# Altium project ACS_MainBrd.PrjPcb
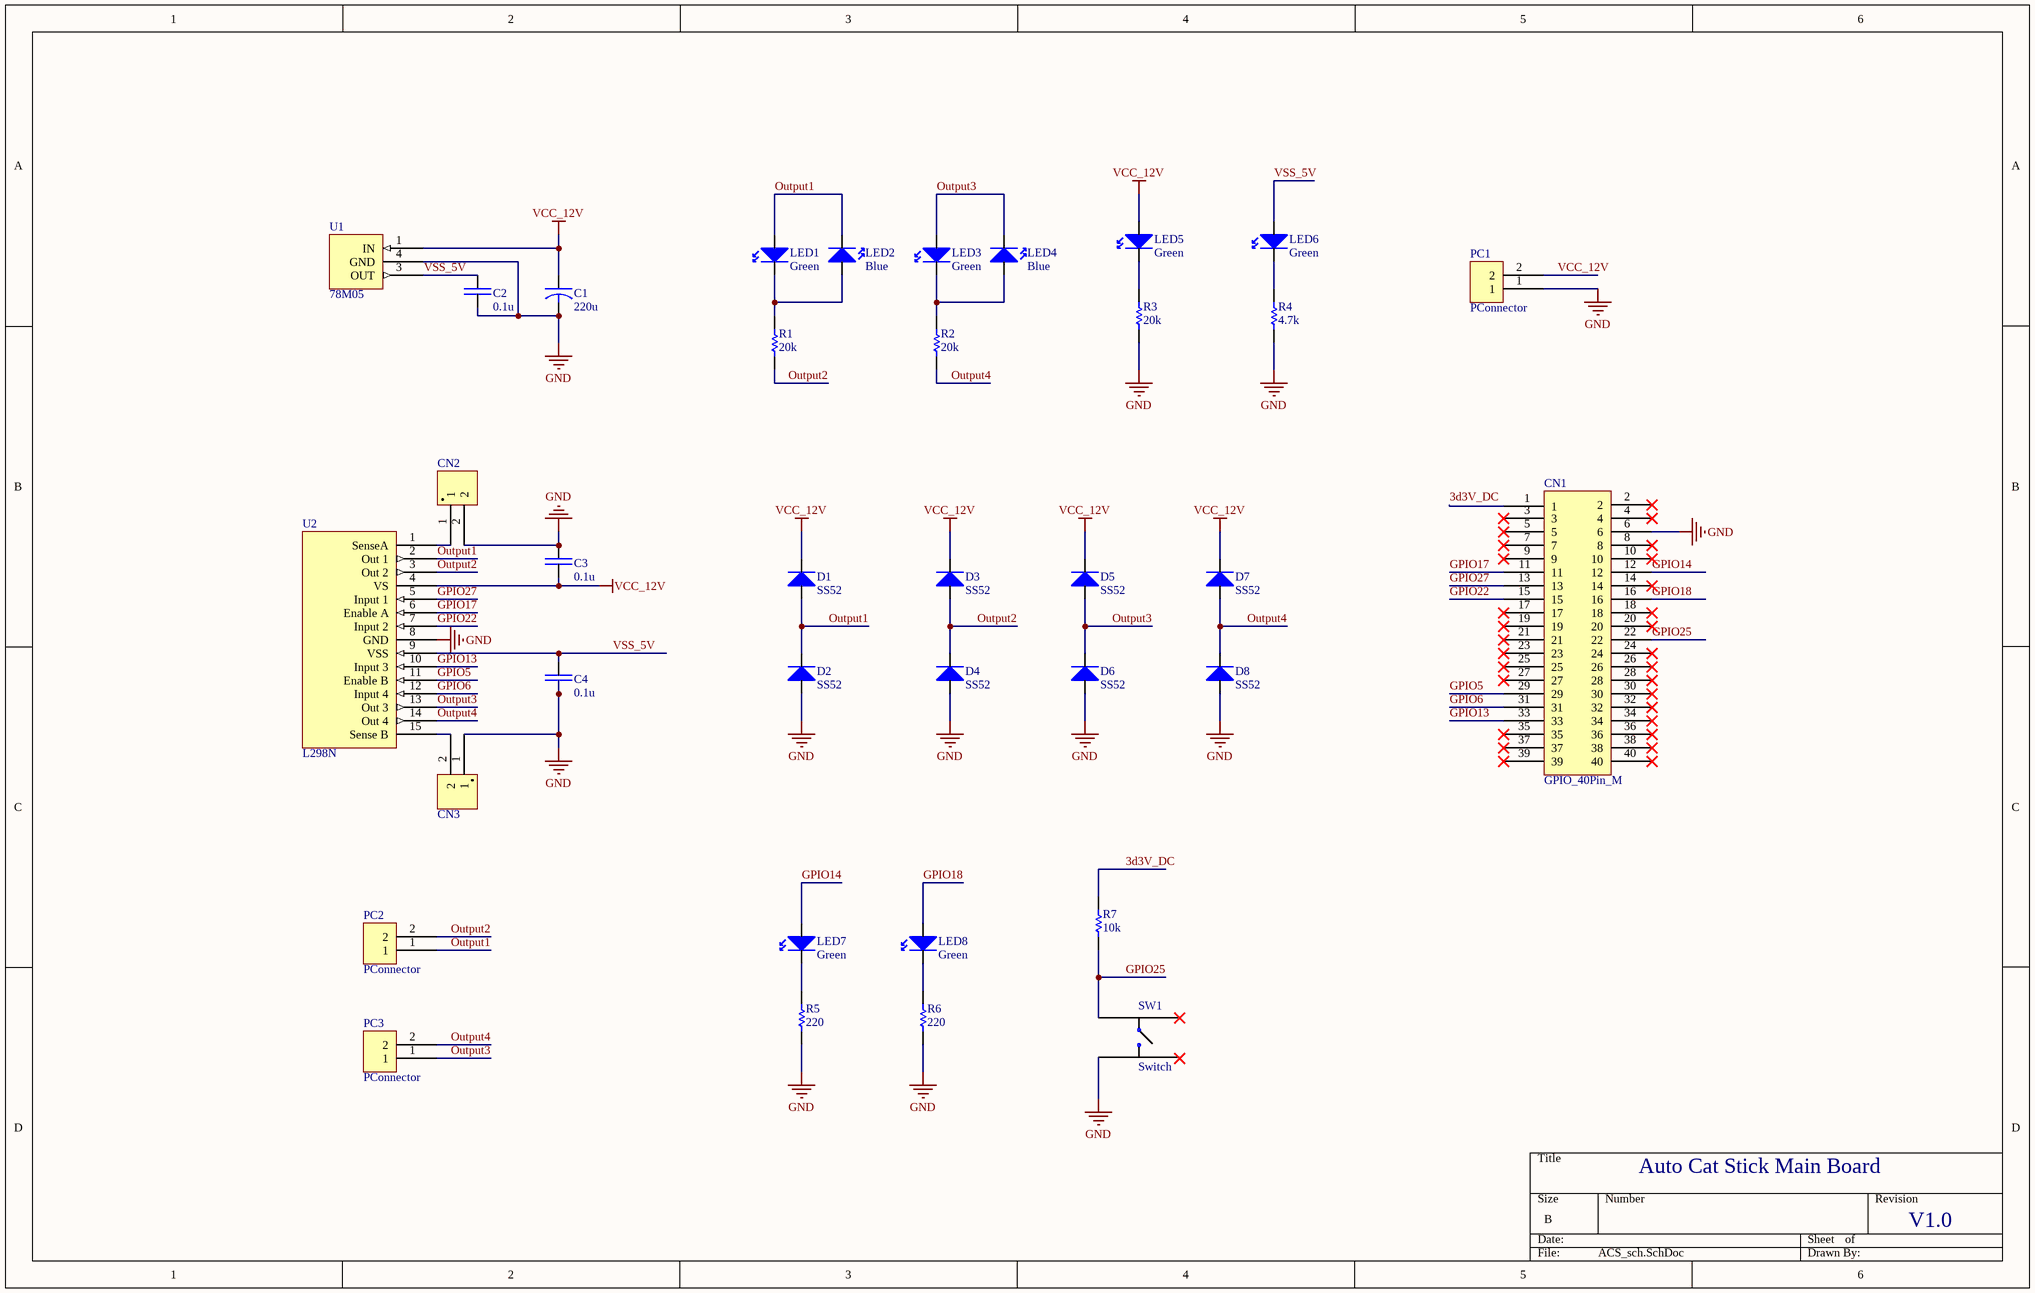
[diagram p0: ACS_sch.SchDoc]
1 sheet, 36 parts. Net scope: global (net labels, ports and power ports of the same name join across sheets).
Board files: ACS_PCB_P1.PcbDoc, ACS_PCB_P2.PcbDoc

## Sheet ACS_sch.SchDoc
size B; SheetNumber: 1; SheetTotal: 1

### Parts
C1  220u  [C0605]
C2  0.1u  [C0603]
C3  0.1u  [C0603]
C4  0.1u  [C0603]
CN1  GPIO_40Pin_M  [GPIO_40Pin_M]
CN2  Connector  [2PIN]  (value not drawn)
CN3  Connector  [2PIN]  (value not drawn)
D1  SS52  [SMC(DO-214AB)]
D2  SS52  [SMC(DO-214AB)]
D3  SS52  [SMC(DO-214AB)]
D4  SS52  [SMC(DO-214AB)]
D5  SS52  [SMC(DO-214AB)]
D6  SS52  [SMC(DO-214AB)]
D7  SS52  [SMC(DO-214AB)]
D8  SS52  [SMC(DO-214AB)]
LED1  Green  [LED0603]
LED2  Blue  [LED0603]
LED3  Green  [LED0603]
LED4  Blue  [LED0603]
LED5  Green  [LED0603]
LED6  Green  [LED0603]
LED7  Green  [LED0603]
LED8  Green  [LED0603]
PC1  PConnector  [PC_2Pin]
PC2  PConnector  [PC_2Pin]
PC3  PConnector  [PC_2Pin]
R1  20k  [R0603]
R2  20k  [R0603]
R3  20k  [R0603]
R4  4.7k  [R0603]
R5  220  [R0603]
R6  220  [R0603]
R7  10k  [R0603]
SW1  Switch  [Switch]
U1  78M05  [78M05]
U2  L298N  [L298N]

### Nets
GND: C1.2 C2.2 C3.1 C4.1 CN1.6 CN2.2 CN3.1 D2.2 D4.2 D6.2 D8.2 PC1.1 R3.1 R4.1 R5.1 R6.1 SW1.3 U1.4(GND) U2.8(GND)
VCC_12V: C1.1 C3.2 D1.1 D3.1 D5.1 D7.1 LED5.2 PC1.2 U1.1(IN) U2.4(VS)
3d3V_DC: CN1.1 R7.2
GPIO5: CN1.29 U2.11(Enable_B)
GPIO6: CN1.31 U2.12(Input_4)
GPIO13: CN1.33 U2.10(Input_3)
GPIO14: CN1.12 LED7.2
GPIO17: CN1.11 U2.6(Enable_A)
GPIO18: CN1.16 LED8.2
GPIO22: CN1.15 U2.7(Input_2)
GPIO25: CN1.22 R7.1 SW1.1
GPIO27: CN1.13 U2.5(Input_1)
Output1: D1.2 D2.1 LED1.2 LED2.1 PC2.1 U2.2(Out_1)
Output2: D3.2 D4.1 PC2.2 R1.1 U2.3(Out_2)
Output3: D5.2 D6.1 LED3.2 LED4.1 PC3.1 U2.13(Out_3)
Output4: D7.2 D8.1 PC3.2 R2.1 U2.14(Out_4)
VSS_5V: C2.1 C4.2 LED6.2 U1.3(OUT) U2.9(VSS)
NetCN2_1: CN2.1 U2.1(SenseA)
NetCN3_2: CN3.2 U2.15(Sense_B)
NetLED1_1: LED1.1 LED2.2 R1.2
NetLED3_1: LED3.1 LED4.2 R2.2
NetLED5_1: LED5.1 R3.2
NetLED6_1: LED6.1 R4.2
NetLED7_1: LED7.1 R5.2
NetLED8_1: LED8.1 R6.2

Not connected (* = marked no-connect by the designer): CN1 2* 3* 4* 5* 7* 8* 9* 10* 14* 17* 18* 19* 20* 21* 23* 24* 25* 26* 27* 28* 30* 32* 34* 35* 36* 37* 38* 39* 40*; SW1 2* 4

### Notes on the sheet
- Auto Cat Stick Main Board
- V1.0

### Library data of the parts
C1 = cap 0605: C0605 Electrolytic Capacitor
C2-C4 = cap 0603 NonE: C0603 non Electrolytic Capacitor
CN1 = GPIO_40Pin_M: GPIO 40pin Male Connector
CN2 CN3 = Connector: 2pin connector
D1-D8 = SS52: SS52 Diode
LED1-LED8 = led 0603: LED0603
PC1-PC3 = PConnector: 2Pin
R1-R7 = Res 0603: Resistor; Rang: 1%; Revision: July-2002: Re-released for DXP Platform.
U1 = 78M05: Linear Voltage Regulators (LDO)
U2 = L298N: HGSEMI L298N